# EAGLE design CAN485 1.0.0 (EAGLE 8.2.1)
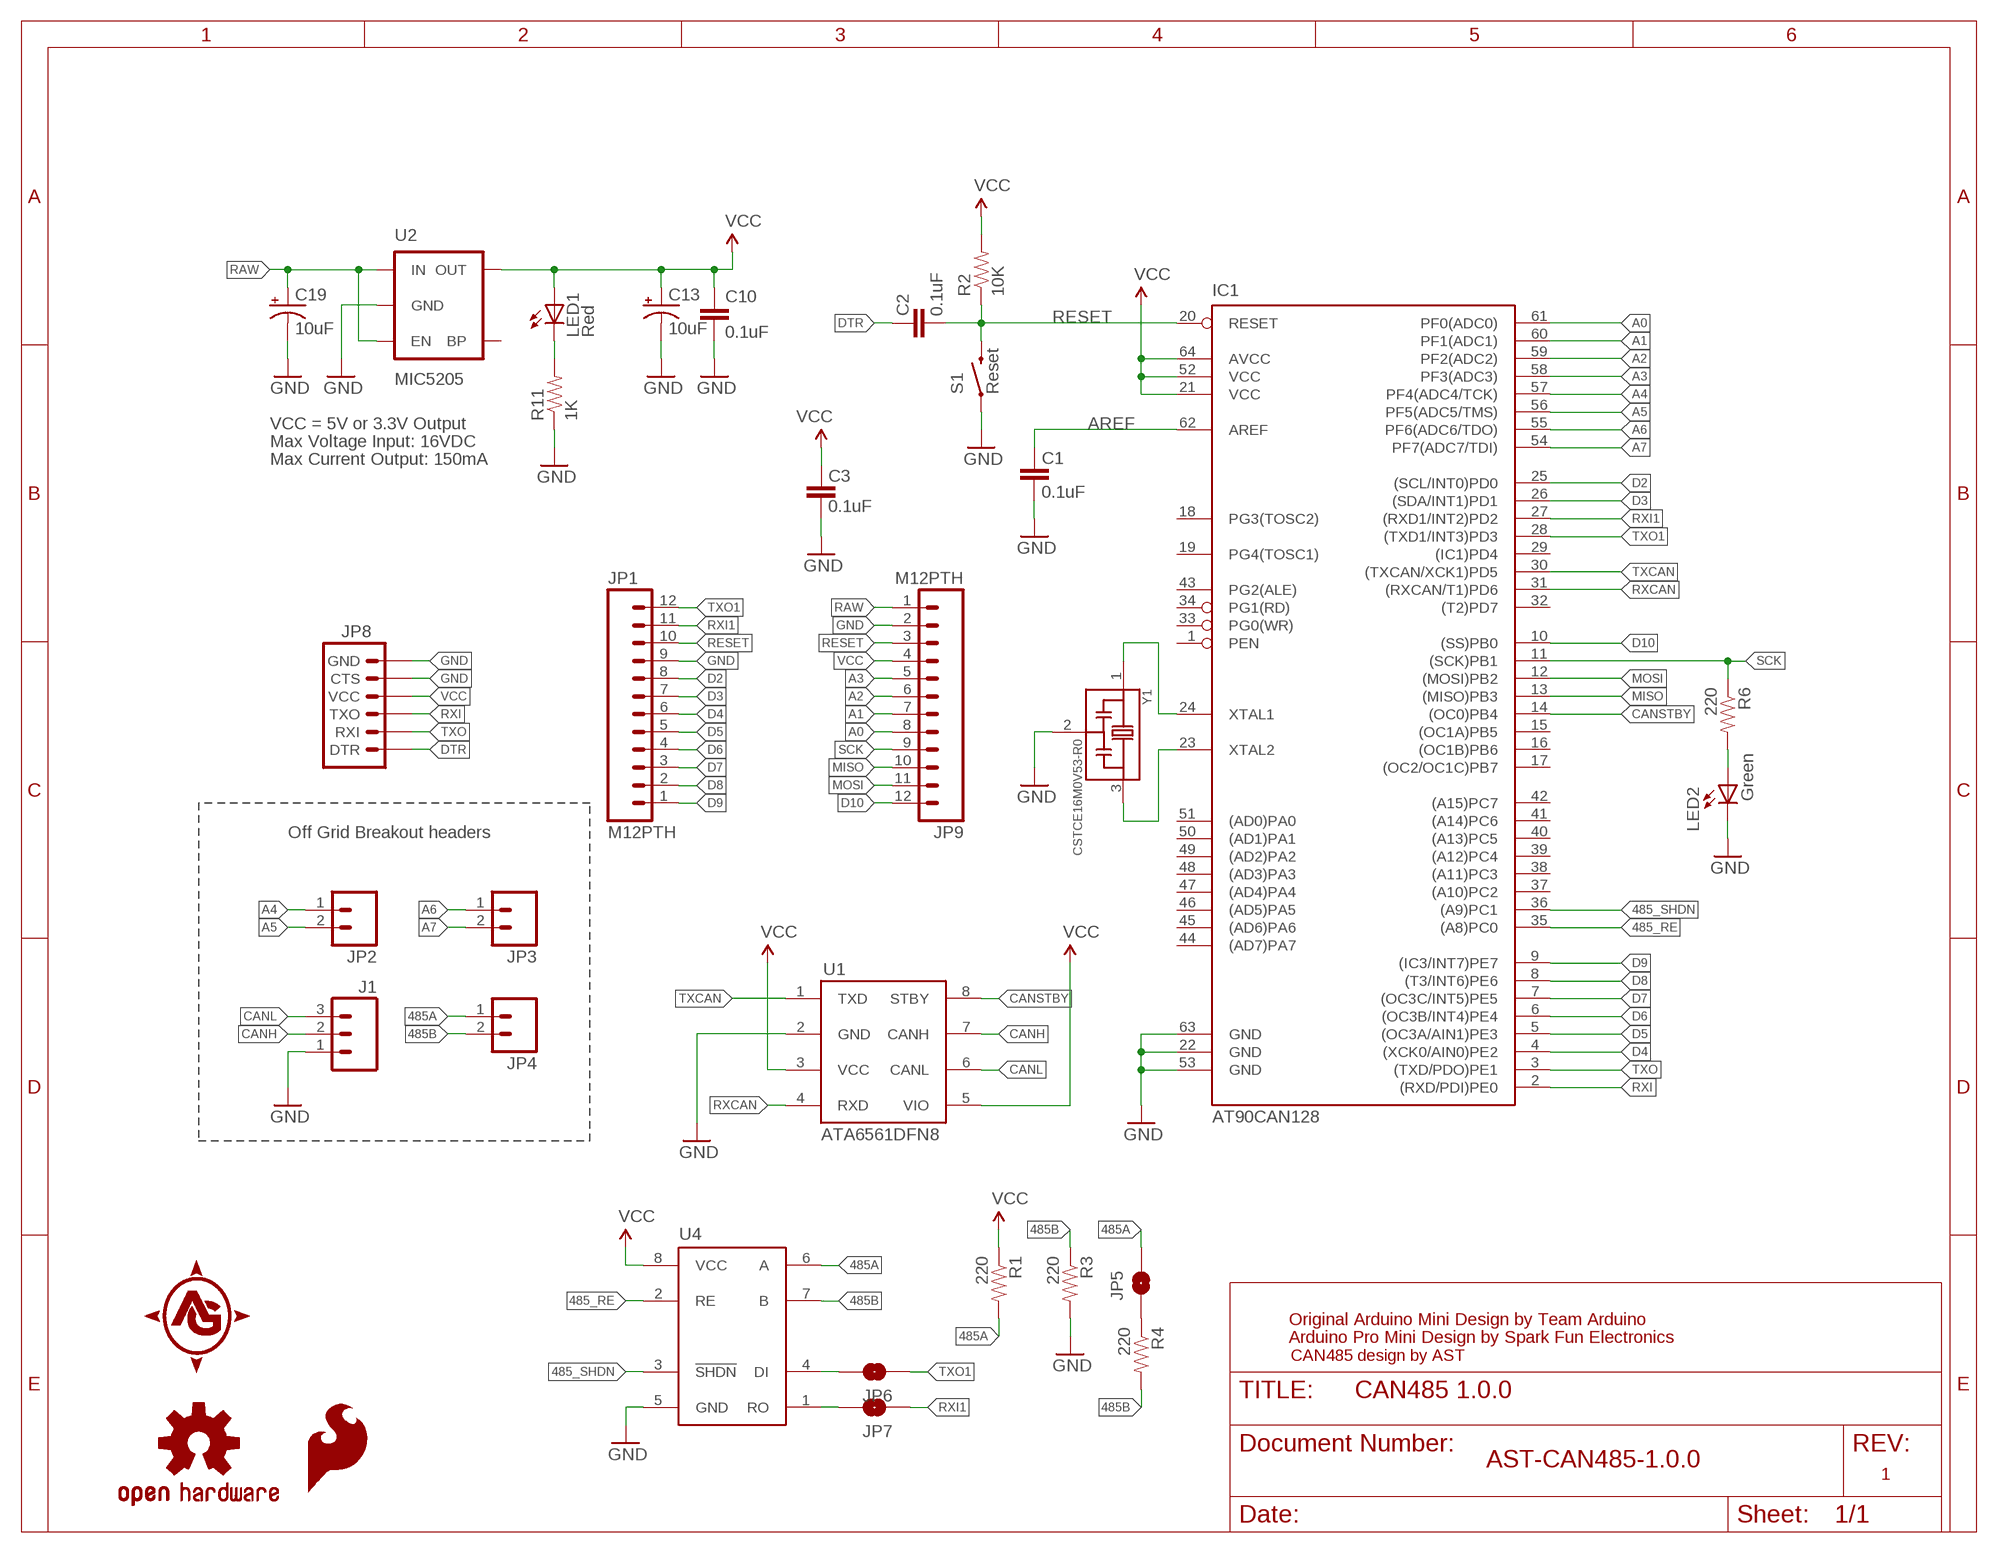
[diagram p0: schematic, sheet 1]

## Parts
C1  0.1uF  CAP0402-CAP  [0402-CAP]
C2  0.1uF  CAP0402-CAP  [0402-CAP]
C3  0.1uF  CAP0402-CAP  [0402-CAP]
C10  0.1uF  CAP0402-CAP  [0402-CAP]
C13  10uF  CAP_POL1206  [EIA3216]
C19  10uF  CAP_POL1206  [EIA3216]
IC1  AT90CAN128  MEGA64-M  [MLF64]
J1  M03PTH  [1X03]
JP1  M12PTH  [1X12]
JP2  M02PTH  [1X02]
JP3  M02PTH  [1X02]
JP4  M02PTH  [1X02]
JP5  JUMPER-PAD-2-NO  [PAD-JUMPER-2-NO_NO_SILK]
JP6  JUMPER-PAD-2-NO  [PAD-JUMPER-2-NO_NO_SILK]
JP7  JUMPER-PAD-2-NO  [PAD-JUMPER-2-NO_NO_SILK]
JP8  ARDUINO_SERIAL_PROGRAMPTH  [1X06]
JP9  M12PTH  [1X12]
LED1  Red  LED  [0603-LED-ALT1]
LED2  Green  LED  [0603-LED-ALT1]
LOGO1  OSHW-LOGOMINI  [OSHW-LOGO-MINI]
LOGO2  SFE_LOGO_FLAME0.05_INCH  [SFE_LOGO_FLAME_.05]
R1  220  RESISTOR0402-RES  [0402-RES]
R2  10K  RESISTOR0402-RES  [0402-RES]
R3  220  RESISTOR0402-RES  [0402-RES]
R4  220  RESISTOR0402-RES  [0402-RES]
R6  220  RESISTOR0402-RES  [0402-RES]
R11  1K  RESISTOR0402-RES  [0402-RES]
S1  Reset  SWITCH-MOMENTARY-2-SMD-1101NE  [TACTILE-SWITCH-1101NE]
U1  ATA6561DFN8  [MSOP8]
U2  MIC5205  V_REG_LDOSMD2  [SC70]
U4  MAX13487SOIC  [MAX13487]
Y1  CSTCE16M0V53-R0  [OSC_CSTCE16M0V53-R0]

## Nets
485_RE: IC1.35((A8)PC0) U4.2(RE)
485_SHDN: IC1.36((A9)PC1) U4.3(!SHDN)
485A: JP4.1 JP5.2 R1.2 U4.6(A)
485B: JP4.2 R3.1 R4.2 U4.7(B)
A0: IC1.61(PF0(ADC0)) JP9.8
A1: IC1.60(PF1(ADC1)) JP9.7
A2: IC1.59(PF2(ADC2)) JP9.6
A3: IC1.58(PF3(ADC3)) JP9.5
A4: IC1.57(PF4(ADC4/TCK)) JP2.1
A5: IC1.56(PF5(ADC5/TMS)) JP2.2
A6: IC1.55(PF6(ADC6/TDO)) JP3.1
A7: IC1.54(PF7(ADC7/TDI)) JP3.2
AREF: C1.2 IC1.62(AREF)
CANH: J1.2 U1.7(CANH)
CANL: J1.3 U1.6(CANL)
CANSTBY: IC1.14((OC0)PB4) U1.8(STBY)
D2: IC1.25((SCL/INT0)PD0) JP1.8
D3: IC1.26((SDA/INT1)PD1) JP1.7
D4: IC1.4((XCK0/AIN0)PE2) JP1.6
D5: IC1.5((OC3A/AIN1)PE3) JP1.5
D6: IC1.6((OC3B/INT4)PE4) JP1.4
D7: IC1.7((OC3C/INT5)PE5) JP1.3
D8: IC1.8((T3/INT6)PE6) JP1.2
D9: IC1.9((IC3/INT7)PE7) JP1.1
D10: IC1.10((SS)PB0) JP9.12
DTR: C2.2 JP8.1(DTR)
GND [vcc]: C1.1 C3.1 C10.2 C13.C(-) C19.C(-) IC1.22(GND) IC1.53(GND) IC1.63(GND) J1.1 JP1.9 JP8.5(CTS) JP8.6(GND) JP9.2 LED2.C R3.2 R11.1 S1.P$1 U1.2(GND) U2.2(GND) U4.5(GND) Y1.2
MISO: IC1.13((MISO)PB3) JP9.10
MOSI: IC1.12((MOSI)PB2) JP9.11
N$1: IC1.23(XTAL2) Y1.3
N$2: IC1.24(XTAL1) Y1.1
N$3: JP5.1 R4.1
N$4: LED1.C R11.2
N$5: JP6.2 U4.4(DI)
N$6: JP7.2 U4.1(RO)
N$7: LED2.A R6.2
RAW [vcc]: C19.A(+) JP9.1 U2.1(IN) U2.3(EN)
RESET: C2.1 IC1.20(RESET) JP1.10 JP9.3 R2.1 S1.P$2
RXCAN: IC1.31((RXCAN/T1)PD6) U1.4(RXD)
RXI: IC1.2((RXD/PDI)PE0) JP8.3(TXO)
RXI1: IC1.27((RXD1/INT2)PD2) JP1.11 JP7.1
SCK: IC1.11((SCK)PB1) JP9.9 R6.1
TXCAN: IC1.30((TXCAN/XCK1)PD5) U1.1(TXD)
TXO: IC1.3((TXD/PDO)PE1) JP8.2(RXI)
TXO1: IC1.28((TXD1/INT3)PD3) JP1.12 JP6.1
VCC: C3.2 C10.1 C13.A(+) IC1.21(VCC) IC1.52(VCC) IC1.64(AVCC) JP8.4(VCC) JP9.4 LED1.A R1.1 R2.2 U1.3(VCC) U1.5(VIO) U2.5(OUT) U4.8(VCC)
Unconnected: IC1.1(PEN) IC1.15((OC1A)PB5) IC1.16((OC1B)PB6) IC1.17((OC2/OC1C)PB7) IC1.18(PG3(TOSC2)) IC1.19(PG4(TOSC1)) IC1.29((IC1)PD4) IC1.32((T2)PD7) IC1.33(PG0(WR)) IC1.34(PG1(RD)) IC1.37((A10)PC2) IC1.38((A11)PC3) IC1.39((A12)PC4) IC1.40((A13)PC5) IC1.41((A14)PC6) IC1.42((A15)PC7) IC1.43(PG2(ALE)) IC1.44((AD7)PA7) IC1.45((AD6)PA6) IC1.46((AD5)PA5) IC1.47((AD4)PA4) IC1.48((AD3)PA3) IC1.49((AD2)PA2) IC1.50((AD1)PA1) IC1.51((AD0)PA0) U2.4(BP)

## Notes on the sheet
- VCC = 5V or 3.3V Output
- Max Voltage Input: 16VDC
- Max Current Output: 150mA
- Off Grid Breakout headers
- Original Arduino Mini Design by Team Arduino
- Arduino Pro Mini Design by Spark Fun Electronics
- CAN485 design by AST
- AST-CAN485-1.0.0
- 1

## Library data of the parts
C1-C3 C10 = SparkFun:CAP: Capacitor Standard 0603 ceramic capacitor, and 0.1" leaded capacitor.
C13 C19 = SparkFun:CAP_POL: Capacitor Polarized These are standard SMD and PTH capacitors. Normally 10uF, 47uF, and 100uF in electrolytic and tantalum varieties. Always verify the external diameter of the through hole cap, it varies with capacity, voltage, and manufacturer. The EIA devices should be standard.
IC1 = atmel:MEGA64: MICROCONTROLLER 64 Kbytes FLASH 4 Kbytes SRAM 2 Kbytes EEPROM DUAL USART 8-channel 10 bit ADC Source: avr.lbr; MPN: ATMEGA64-16MU; OC_FARNELL: 1455120; OC_NEWARK: 58M3742
J1 = SparkFun-Connectors:M03: Header 3 Standard 3-pin 0.1" header. Use with straight break away headers (SKU : PRT-00116), right angle break away headers (PRT-00553), swiss pins (PRT-00743), machine pins (PRT-00117), and female headers (PRT-00115). Molex polarized connector foot print use with SKU : PRT-08232 with associated crimp pins and housings.
JP1 JP9 = SparkFun:M12: Header 12 Standard 12-pin 0.1" header. Use with straight break away headers (SKU : PRT-00116), right angle break away headers (PRT-00553), swiss pins (PRT-00743), machine pins (PRT-00117), and female headers (PRT-00115).
JP2-JP4 = SparkFun:M02: Header 2 Standard 2-pin 0.1" header. Use with straight break away headers (SKU : PRT-00116), right angle break away headers (PRT-00553), swiss pins (PRT-00743), machine pins (PRT-00117), and female headers (PRT-00115). Molex polarized connector foot print use with SKU : PRT-08233 with associated crimp pins and housings.
JP5-JP7 = SparkFun-Passives:JUMPER-PAD-2-NO
JP8 = SparkFun:ARDUINO_SERIAL_PROGRAM
LED1 LED2 = Testing:LED: LEDs Standard schematic elements and footprints for 5mm, 3mm, 1206, and 0603 sized LEDs. 5mm - Spark Fun Electronics SKU : COM-00529 (and others)
LOGO1 = SparkFun-Aesthetics:OSHW-LOGO: Open Source Hardware Logo This logo indicates the piece of hardware it is found on incorporates a OSHW license and/or adheres to the definition of open source hardware found here: http://freedomdefined.org/OSHW
LOGO2 = SparkFun-Aesthetics:SFE_LOGO_FLAME: SFE Logo, flame only This is the SparkFun flame logo. The logo on the schematic will always be the same size; the package variant is the height of the flame. Default layer for the logo on the board is tSilk.
R1-R4 R6 R11 = SparkFun:RESISTOR: Resistor Basic schematic elements and footprints for 0603, 1206, and PTH resistors.
S1 = Testing:SWITCH-MOMENTARY-2: Various NO switches- pushbuttons, reed, etc
U1 = atmel:ATA6561: High speed CAN transceiver
U2 = SparkFun:V_REG_LDO: Voltage Regulator LDO Standard 150mA LDO voltage regulator in SOT-23 layout. Micrel part MIC5205. BP (by-pass) pin is used to lower output noise with 470pF cap.
U4 = AET:MAX13487
Y1 = CSTCE16M0V53-R0:CSTCE16M0V53-R0: 16MHz Ceramic Resonator Built in Capacitor 15pF ±0.3% -20°C ~ 80°C Surface Mount; AVAILABILITY: Good; DESCRIPTION: Ceramic Resonator 16MHz ??0.5% (Tol) ??0.3% (Stability) 15pF 40Ohm 3-Pin CSMD T/R; MF: Murata; MP: CSTCE16M0V53-R0; PACKAGE: SMD-3 Murata; PRICE: 0.29 USD

## Net classes
0 default: width 0.203 mm
1 vcc: width 0.254 mm

## Board
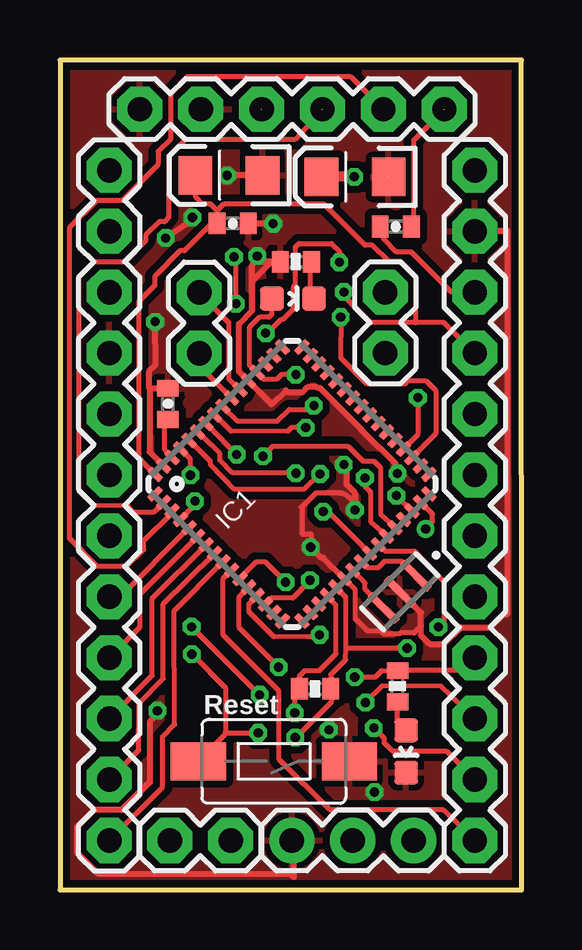
[diagram p1: board, top side]
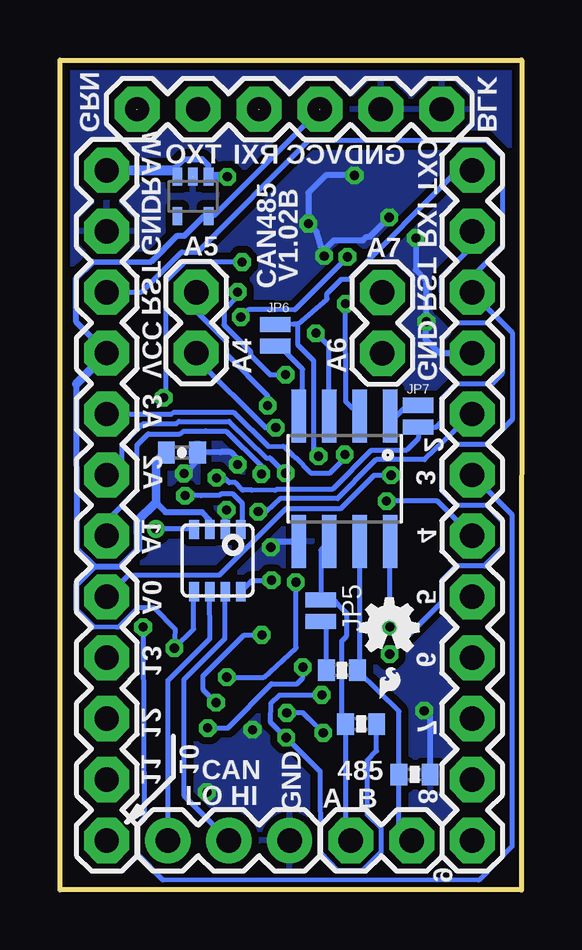
[diagram p2: board, bottom side, seen from below]

Size 19.25 x 34.6 mm. Coordinates in mm from the lower left corner, seen from the top.
Outline: 0,34.6 0.01,0 19.25,0 19.24,34.6 0,34.6
Copper layers (1*16): Top 0.035mm / dielectric 1.5mm / Bottom 0.035mm
Design rules "SparkFun-2-layer-TIGHT *": minimum track width 7mil, minimum drill 15mil, track to track 7mil, track to pad 7mil, pad to pad 7mil, via to via 7mil, smd to smd 7mil, copper to edge 7mil, drill to drill 7mil, minimum pad ring 7mil, minimum via ring 7mil, stop-mask expansion 4mil, vias tented up to drill 25mil, thermal gap 10mil

### Footprints (pad centres in the part's own frame; a part is rotated, then mirrored left to right if it is on the bottom)
0402-CAP = smd 0.7 x 0.9: 1 -0.65,0; 2 0.65,0
EIA3216 = smd 1.4 x 1.6: A 1.4,0; C -1.4,0
MLF64 = smd 0.7 x 0.3: 1 -4.325,3.75; 2 -4.325,3.25; 3 -4.325,2.75; 4 -4.325,2.25; 5 -4.325,1.75; 6 -4.325,1.25; 7 -4.325,0.75; 8 -4.325,0.25; 9 -4.325,-0.25; 10 -4.325,-0.75; 11 -4.325,-1.25; 12 -4.325,-1.75; 13 -4.325,-2.25; 14 -4.325,-2.75; 15 -4.325,-3.25; 16 -4.325,-3.75; 33 4.325,-3.75; 34 4.325,-3.25; 35 4.325,-2.75; 36 4.325,-2.25; 37 4.325,-1.75; 38 4.325,-1.25; 39 4.325,-0.75; 40 4.325,-0.25; 41 4.325,0.25; 42 4.325,0.75; 43 4.325,1.25; 44 4.325,1.75; 45 4.325,2.25; 46 4.325,2.75; 47 4.325,3.25; 48 4.325,3.75 | smd 0.3 x 0.7: 17 -3.75,-4.325; 18 -3.25,-4.325; 19 -2.75,-4.325; 20 -2.25,-4.325; 21 -1.75,-4.325; 22 -1.25,-4.325; 23 -0.75,-4.325; 24 -0.25,-4.325; 25 0.25,-4.325; 26 0.75,-4.325; 27 1.25,-4.325; 28 1.75,-4.325; 29 2.25,-4.325; 30 2.75,-4.325; 31 3.25,-4.325; 32 3.75,-4.325; 49 3.75,4.325; 50 3.25,4.325; 51 2.75,4.325; 52 2.25,4.325; 53 1.75,4.325; 54 1.25,4.325; 55 0.75,4.325; 56 0.25,4.325; 57 -0.25,4.325; 58 -0.75,4.325; 59 -1.25,4.325; 60 -1.75,4.325; 61 -2.25,4.325; 62 -2.75,4.325; 63 -3.25,4.325; 64 -3.75,4.325
1X03 = drill 1.016 pad 1.88: 1 0,0; 2 2.54,0; 3 5.08,0
1X12 = drill 1.016 pad 1.88 octagon: 1 0,0; 2 2.54,0; 3 5.08,0; 4 7.62,0; 5 10.16,0; 6 12.7,0; 7 15.24,0; 8 17.78,0; 9 20.32,0; 10 22.86,0; 11 25.4,0; 12 27.94,0
1X02 = drill 1.016 pad 1.88 octagon: 1 0,0; 2 2.54,0
PAD-JUMPER-2-NO_NO_SILK = smd 0.635 x 1.27: 1 -0.45,0; 2 0.45,0
1X06 = drill 1.016 pad 1.88 octagon: 1 0,0; 2 2.54,0; 3 5.08,0; 4 7.62,0; 5 10.16,0; 6 12.7,0
0603-LED-ALT1 = smd 1 x 1: A 0,-0.877; C 0,0.877
0402-RES = smd 0.7 x 0.9: 1 -0.65,0; 2 0.65,0
TACTILE-SWITCH-1101NE = smd 2.3 x 1.6: P$1 -3.15,0; P$2 3.15,0
MSOP8 = smd 0.4 x 0.8: 1 -0.975,-1.298; 2 -0.325,-1.298; 3 0.325,-1.298; 4 0.975,-1.298; 5 0.975,1.298; 6 0.325,1.298; 7 -0.325,1.298; 8 -0.975,1.298
SC70 = smd 0.4 x 0.75: 1 -0.65,-0.825; 2 0,-0.825; 3 0.65,-0.825; 4 0.65,0.825; 5 -0.65,0.825
MAX13487 = smd 0.61 x 2.21: 1 -1.905,-2.616; 2 -0.635,-2.616; 3 0.635,-2.616; 4 1.905,-2.616; 5 1.905,2.616; 6 0.635,2.616; 7 -0.635,2.616; 8 -1.905,2.616
OSC_CSTCE16M0V53-R0 = smd 0.3 x 1.6: 1 -0.95,0; 2 0,0; 3 0.95,0

### Placement (x,y rotation side)
C1  4.5,20.26 270 top
C2  14.01,27.65 0 top
C3  14.16,18.23 180 bottom
C10  7.21,27.78 0 top
C13  7.05,29.79 180 top
C19  12.31,29.72 180 top
IC1  9.68,16.92 45 top
J1  9.67,2.06 0 top
JP1  2.06,2.06 90 top
JP2  13.57,22.38 90 top
JP3  5.81,22.37 90 top
JP4  7.12,2.06 180 top
JP5  8.38,11.64 90 bottom
JP6  10.28,23.12 270 bottom
JP7  4.32,19.75 90 bottom
JP8  16.03,32.55 180 top
JP9  17.3,30 270 top
LED1  9.71,24.65 270 top
LED2  14.43,5.77 180 top
LOGO1  5.51,10.94 0 bottom
LOGO2  6.27,7.48 0 bottom
R1  6.69,6.92 180 bottom
R2  10.64,8.38 0 top
R3  4.46,4.81 0 bottom
R4  7.49,9.16 0 bottom
R6  14.08,8.49 270 top
R11  9.84,26.19 0 top
S1  8.92,5.36 180 top
U1  12.68,13.73 180 bottom
U2  13.7,28.91 180 bottom
U4  7.38,17.14 180 bottom
Y1  14.17,12.43 225 top

### Tracks (layer width: path | path; a pad name or v marks a point on that pad's centre or on a via)
485_RE  (via drill 0.38)
  Top 0.203: v11.71,23.88 11.7,22.19 12.78,21.12 14.43,21.12 14.54,21.23 15.25,21.23 15.67,20.81 15.67,19.03 14.69,18.05 IC1.35 | v7.26,26.39 7.34,26.31 v7.34,24.44
  Bottom 0.203: v11.71,23.88 11.39,24.19 10.4,24.19 9.46,24.18 v7.26,26.39 | v7.34,24.44 7.33,20.34 U4.2
485_SHDN  (via drill 0.38)
  Top 0.203: v14.93,20.52 14.92,18.99 IC1.36 | v11.65,26.17 11.65,26.63 11.33,26.95 9.97,26.95 9.82,26.8 9.82,25.23 9.74,25.15 9.74,24.21 9.32,23.79 9.24,23.79 8.66,23.21 v8.58,23.21
  Bottom 0.203: v14.93,20.52 14.84,20.65 14.84,25.39 14.06,26.17 v11.65,26.17 | v8.58,23.21 8.04,22.67 8.04,20.77 8.08,20.54 8.11,19.85 U4.3
485A
  Bottom 0.203: U4.6 8.37,14.17 JP5.2 8.27,12.05 7.78,12.05 7.47,11.71 7.29,11.53 7.29,10.59 7.49,10.39 7.49,7.12 7.39,7.01 R1.2 7.33,2.27 JP4.1
485B
  Bottom 0.203: JP4.2 4.55,2.09 5.11,2.65 R3.1 5.11,7.44 6.82,9.11 R4.2 6.79,9.25 6.75,9.29 U4.7
A0  (via drill 0.38)
  Top 0.203: v5.44,17.29 5.44,17.96 5.19,18.21 5.19,18.23 5.05,18.37 IC1.61
  Bottom 0.203: v5.44,17.29 6.14,17.29 7.53,15.91 9.82,15.91 12.59,13.14 16.38,13.14 JP9.8
A1  (via drill 0.38)
  Top 0.203: v10.85,17.34 v10.84,17.35 10.18,16.7 7.29,16.7 6.28,17.73 6.28,17.87 5.61,18.53 5.59,18.53 IC1.60
  Bottom 0.203: v10.85,17.34 10.85,17.67 12.33,19.13 13.16,19.14 14.09,19.13 14.24,19.01 15.57,19.01 16.04,18.54 16.03,16.67 17.28,15.4 JP9.7
A2  (via drill 0.38)
  Top 0.203: v9.84,17.37 9.71,17.39 7.2,17.39 6.67,17.92 6.67,18.19 5.97,18.89 5.95,18.89 IC1.59
  Bottom 0.203: v9.84,17.37 10.49,18.01 10.64,18.01 12.19,19.53 14.3,19.53 14.4,19.44 15.78,19.44 16.66,18.56 16.66,17.94 JP9.6
A3  (via drill 0.38)
  Top 0.203: v7.37,18.15 6.25,19.27 6.25,19.29 6.11,19.43 IC1.58
  Bottom 0.203: v7.37,18.15 7.53,17.99 7.53,17.84 7.98,17.39 8.8,17.39 9.43,18.02 9.55,18.13 9.93,18.5 10.56,18.49 12.02,19.92 14.5,19.92 14.61,19.83 JP9.5
A4  (via drill 0.38)
  Top 0.203: v10.25,19.27 9.65,19.27 9.49,19.12 7.13,19.13 6.67,19.59 6.65,19.59 IC1.57
  Bottom 0.203: v10.25,19.27 10.68,19.27 13.53,22.12 JP2.1
A5  (via drill 0.38)
  Top 0.203: IC1.56 6.85,20.16 6.84,20.15 IC1.56 | 6.79,20.18 IC1.56 | IC1.56 7.41,19.54 9.06,19.54 9.55,20.03 10.41,20.03 v10.59,20.19
  Bottom 0.203: v10.59,20.19 10.58,20.59 12.29,22.31 12.3,22.86 13.58,24.14 13.58,24.33 JP2.2
A6
  Top 0.203: IC1.55 | IC1.55 5.82,21.84 JP3.1 | IC1.55
A7
  Top 0.203: JP3.2 7.04,23.66 7.04,21.31 7.49,20.88 7.49,20.87 IC1.54
AREF
  Top 0.203: IC1.62 4.67,18.05 4.67,18.06 4.35,18.38 4.35,19.5 C1.2
CANH
  Bottom 0.203: U1.7 12.37,10.48 14.07,8.78 14.07,3.93 J1.2
CANL
  Bottom 0.203: J1.3 14.74,8.74 13,10.48 U1.6
CANSTBY  (via drill 0.38)
  Top 0.203: v10.43,12.91 10.09,12.57 10.09,12.55 9.71,12.17 8.81,12.17 IC1.14
  Bottom 0.203: v10.43,12.91 11.23,12.91 11.69,12.45 U1.8
D2  (via drill 0.38)
  Top 0.203: v10.98,15.77 11.17,15.77 12.69,14.25 12.71,14.25 IC1.25
  Bottom 0.203: v10.98,15.77 10.64,15.77 10.06,16.31 7.67,16.31 6.28,17.73 6.17,17.85 6.07,17.94 4.05,17.94 JP1.8
D3  (via drill 0.38)
  Top 0.203: v15.78,10.96 v15.78,10.95 16.03,11.2 16.03,12.85 14.82,14.12 13.57,14.12 13.29,14.39 IC1.26
  Bottom 0.203: v15.78,10.96 15.77,10.74 15.77,10.7 15.72,3 16.02,2.7 16.02,1.48 14.96,0.42 1.79,0.41 0.4,1.81 0.4,15.65 JP1.7
D4  (via drill 0.38)
  Top 0.203: v5.63,16.21 5.69,16.15 5.69,16.13 5.19,15.63 5.19,15.61 5.05,15.47 IC1.4
  Bottom 0.203: v5.63,16.21 3.51,16.21 JP1.6
D5
  Top 0.203: IC1.5 2.5,12.22 JP1.5
D6
  Top 0.203: JP1.4 3.34,10.96 3.34,12.34 IC1.6
D7
  Top 0.203: JP1.3 3.85,8.94 3.85,12.16 IC1.7
D8
  Top 0.203: JP1.2 3.03,5.56 3.29,5.82 3.3,7.77 4.31,8.8 4.31,11.92 IC1.8
D9
  Top 0.203: JP1.1 4.28,4.28 4.28,6.39 4.79,6.9 4.77,11.64 6.77,13.65 IC1.9
D10
  Top 0.203: JP9.12 15.98,3.33 11.27,3.33 9.14,5.45 9.13,8.29 6.81,10.63 6.81,12.98 IC1.10
DTR  (1 unrouted)
  Top 0.203: 16.03,32.53 14.74,31.24 14.74,27.74 C2.2
GND  (via drill 0.38)  (1 unrouted)
  Top 0.203: 15.06,10.61 15.06,11.01 14.76,10.71 14.75,10.73 14.21,10.73 14.17,10.69 13.48,10.69 13.38,10.79 12.83,10.79 12.31,11.31 12.31,12.52 IC1.22 | v12.3,15.84 arc90 11.59,16.55 10.68,16.55 10.07,15.95 10.09,15.95 10.09,14.84 10.46,14.84 v10.46,14.29
  Top 0.254: v3.97,23.69 3.97,23.61 3.98,21.9 3.98,21.89 3.72,21.63 3.72,20.91 C1.1 3.73,20.91 3.73,18.27 IC1.63 | v14.08,17.36 13.99,17.45 13.99,17.77 12.64,19.12 12.52,19.25 10.84,20.93 10.74,20.93 10.71,20.96 10.33,20.96 10.11,20.74 9.5,20.74 9.42,20.82 8.82,20.24 8.82,20.25 IC1.53 7.46,21.61 7.46,23.6 8.02,24.16 | 8.02,24.16 8.03,24.17 8.03,25.41 8.82,26.19 | 8.82,26.19 R11.1 | 8.82,26.19 8.55,26.19 arc-90 v8.23,26.43 8.02,26.03 8.02,24.16 | v8.89,27.78 C10.2 | C13.C 6.99,29.79 6.96,29.82 v6.96,29.8 v6.97,29.79 | IC1.22 10.97,13.85 10.9,13.85 v10.46,14.29 | v12.3,15.84 12.3,16.56 11.96,16.9 11.96,17.73 v11.84,17.73 | v5.52,28.04 5.67,28.03 v4.41,27.18 | v4.06,7.47 4.06,7.33 3.74,7.01 3.74,4.5 2.58,3.33 1.43,3.33 0.7,2.61 0.7,1.57 1.59,0.68 9.6,0.68 9.75,0.53 9.75,1.98 J1.1 | Y1.2 14.67,11.95 14.71,11.91 14.85,11.76 14.81,11.8 15.06,11.55 15.06,11.01 | 15.06,10.61 15.41,10.26 16.03,10.26 16.73,10.95 17.96,10.95 18.5,11.49 18.62,11.48 18.67,11.53 18.67,27.47 18.66,27.46 JP9.2
  Bottom 0.254: JP1.9 3.42,22.38 4.03,22.99 v3.97,23.69 v3.98,23.7 3.98,25.43 4.41,25.86 v4.41,27.18 | v14.08,17.36 13.82,17.62 13.78,17.62 13.43,18.01 C3.1 12.55,18.25 12.12,18.25 11.84,17.97 v11.84,17.73 | v6.97,29.79 8.16,29.79 8.89,29.06 v8.89,27.78 8.55,27.44 v8.23,26.43 8.47,26.44 7.83,27.08 6.61,27.08 6.46,27.23 6.32,27.23 v5.52,28.04 | v10.46,14.29 10.52,14.34 10.33,14.53 U4.5 | U1.2 12.36,15.96 v12.3,15.84 | R3.2 3.81,7.22 v4.06,7.47
  other vias: 11.22,6.68 13.12,4.08
  pour Top (isolate 0.305): 0.13,34.59 19.11,34.69 19.17,0.02 0.19,-0.08
  pour Bottom (isolate 0.305): 0.13,34.62 19.11,34.67 19.14,0.02 0.16,-0.03
MISO  (via drill 0.38)
  Top 0.203: v10.83,10.63 10.75,10.55 10.33,10.55 8.91,10.56 7.89,11.58 7.88,11.92 8.21,12.25 IC1.13 | v12.74,7.81 13.44,8.5 15.89,8.49 JP9.10
  Bottom 0.203: v10.83,10.63 11.57,10.63 12.86,9.34 13.29,8.92 13.28,8.35 12.71,7.77 v12.74,7.81
MOSI  (via drill 0.38)
  Top 0.203: v9.12,9.29 8.56,9.86 7.47,10.95 7.47,12.22 7.67,12.42 IC1.12 | v13.09,6.75 13.53,6.32 13.53,6.13 13.89,5.77 16.13,5.77 JP9.11
  Bottom 0.203: v9.12,9.29 9.12,8.84 9.36,8.59 10.43,8.59 12.25,6.75 v13.09,6.75
N$1
  Top 0.203: Y1.3 12.72,12.56 12.72,12.79 12.21,13.3 IC1.23
N$2
  Top 0.203: Y1.1 14.25,13.7 13.53,13.7 13.26,13.43 12.83,13.43 12.58,13.68 IC1.24
N$3
  Bottom 0.203: R4.1 8.15,10.97 JP5.1
N$4
  Top 0.203: R11.2 10.45,26.19 10.45,24.75 10.59,24.61 LED1.C
N$5
  Bottom 0.203: U4.4 9.13,19.91 9.13,21.71 9.15,21.74 9.53,22.12 10.03,22.61 JP6.2
N$6
  Bottom 0.203: JP7.2 4.78,20.2 5.22,19.76 U4.1
N$7
  Top 0.203: R6.2 14.08,6.9 LED2.A
RAW  (via drill 0.38)
  Top 0.254: C19.A
  Top 0.406: v12.27,29.73 C19.A
  Bottom 0.254: 14.47,30.01 U2.3 14.35,29.75 14.35,30.21 14.09,30.47 13.33,30.47 13.07,30.21 13.07,29.75 U2.1 12.93,29.73 | JP9.1
  Bottom 0.406: JP9.1 14.47,30.01 | 12.93,29.73 v12.27,29.73
RESET  (via drill 0.38)
  Top 0.203: IC1.20 11.15,12.25 11.51,11.89 11.52,9.84 10.83,9.15 10.21,9.15 9.99,8.93 R2.1 9.8,8.21 v9.79,7.38 | 6.95,6.55 v8.27,6.55 | 6.95,6.55 S1.P$2 | C2.1 13.53,27.65 13.51,27.63 13.51,27.13 14.04,26.6 14.65,26.6 16.32,24.93 JP9.3 | v5.5,9.83 6.9,8.43 6.9,6.59 6.95,6.55
  Bottom 0.203: v8.27,6.55 8.87,7.14 9.11,7.38 v9.79,7.38 | JP9.3 15.85,24.93 14.17,26.6 13.51,26.6 8.87,31.25 1.44,31.25 0.8,30.61 0.8,26.81 2.05,25.56 JP1.10 2.01,24.83 0.39,23.23 0.39,19.61 1.44,18.56 2.69,18.57 3.34,17.92 3.34,16.67 2.71,16.04 1.47,16.04 0.8,15.37 0.8,14.25 1.55,13.5 2.71,13.5 3.34,12.88 3.34,11.98 5.5,9.85 v5.5,9.83
RXCAN  (via drill 0.38)
  Top 0.203: v15.25,15.05 15.54,15.34 15.54,15.67 15.43,15.77 IC1.31
  Bottom 0.203: v15.25,15.05 13.67,15.05 U1.4
RXI  (1 unrouted)
  Top 0.203: 10.95,32.53 9.8,31.28 5.23,31.28 4.54,30.6 4.54,28.04 4.36,27.86 4.15,27.86 3.58,27.29 3.58,27.07 2.69,26.18 1.41,26.18 0.79,25.55 0.79,16.66 1.43,16.03 2.78,16.04 3.06,15.76 3.92,15.76 IC1.2
RXI1  (via drill 0.38)
  Top 0.203: v12.72,17.18 12.72,16.81 12.95,16.58 12.95,15.37 13.4,14.96 IC1.27
  Bottom 0.203: v12.72,17.18 12.72,17.16 12.37,17.16 12.19,16.98 11.93,16.98 11.63,16.67 11.25,16.67 10.29,16.66 10.2,16.7 7.89,16.7 6.26,18.33 4.79,18.34 4.31,18.82 JP7.1 | JP7.1 3.56,19.29 3.33,19.52 3.33,20.48 2.69,21.12 1.22,21.12 0.79,21.55 0.79,23 1.41,23.63 2.68,23.63 3.33,24.28 3.34,25.55 2.08,26.81 JP1.11 | JP7.1
SCK  (via drill 0.38)
  Top 0.203: v9.41,12.83 8.57,13.67 8.17,13.67 7.71,13.21 7.71,13.19 IC1.11 | v12.29,8.87 13.14,8.87 13.41,9.14 R6.1 16.73,9.15 JP9.9
  Bottom 0.203: v9.41,12.83 9.4,10.09 10.74,8.87 v12.29,8.87
TXCAN  (via drill 0.38)
  Top 0.203: v14.03,16.44 14.14,16.34 IC1.30
  Bottom 0.203: v14.03,16.44 13.36,16.44 12.6,16.45 12.54,16.5 12.03,16.5 11.64,16.12 11.64,15.1 U1.1
TXO
  Top 0.203: JP8.2 12.13,33.9 5.3,33.9 4.61,33.19 4.61,31.28 4.09,30.78 4.09,30.24 2.6,28.74 1.53,28.74 0.39,27.61 0.39,14.67 1.54,13.5 2.79,13.5 3.49,14.19 3.49,14.54 4.67,15.71 4.67,15.79 IC1.3
TXO1  (via drill 0.38)
  Top 0.203: v8.47,18.08 8.88,18.5 12.01,18.5 12.64,17.88 13.1,17.88 13.37,17.61 13.37,15.67 13.75,15.31 13.77,15.31 IC1.28
  Bottom 0.203: v8.47,18.08 8.65,18.23 8.66,19.21 8.66,22.05 9.32,22.71 9.32,23.58 9.51,23.58 JP6.1 9.33,23.58 8.11,24.64 8.11,24.87 7.52,25.46 7.17,25.46 2.67,29.99 JP1.12
VCC  (via drill 0.38)  (1 unrouted)
  Top 0.203: 11.92,10.09 11.91,9.59 11.3,8.98 R2.2 11.31,8.96 11.32,7.83 v9.82,6.35 v9.81,6.35 | 11.92,10.09 11.92,12.2 IC1.21 | v14.48,10.08 14.07,10.09 11.92,10.09 | v8.33,8.13 v5.49,10.97 | IC1.64 3.29,18 3.29,24.53 3.95,25.19 3.95,25.57 5.02,26.65 5.19,26.65 6.34,27.79 C10.1 | C13.A 5.65,28.91 5.95,28.59 6.29,28.59 6.56,28.32 C10.1 | IC1.52 7.89,21.9 7.89,23.44 8.33,23.88 8.71,23.88 8.84,24.01 LED1.A | IC1.52 8.5,21.28 9.03,21.28 9.23,21.48 v9.84,21.48 | 14.84,23.65 16.02,23.65 JP9.4 | 14.84,23.65 12.95,23.65 11.84,24.76 v11.84,24.93 | IC1.52 | 14.84,23.65 14.84,25.55 14.2,26.19 13.71,26.19 13.02,26.88 12.72,26.88 11.02,28.58 6.83,28.58 6.56,28.31 C10.1
  Bottom 0.203: U1.5 13.67,10.88 v14.48,10.08 14.45,10.89 15.31,11.75 16,11.75 16.81,10.95 16.9,10.95 17.85,10.96 18.56,11.68 | R1.1 6.05,5.79 6.43,5.41 6.43,3.14 5.85,2.56 5.85,1.58 6.61,0.82 7.69,0.82 8.39,1.55 8.4,4.95 v9.81,6.35 v9.82,6.34 10.46,6.98 10.44,7.8 10.1,8.13 v8.33,8.13 | v5.49,10.97 5.49,14.51 U4.8 | 15.28,16.12 15.25,16.15 | 8.41,32.53 12.85,28.09 U2.5 | v11.84,24.93 11.84,24.75 12.41,24.18 12.41,23.55 11.31,22.45 11.31,22.3 10.49,21.48 v9.84,21.48 | 17.83,13.49 17.81,13.49 | 17.35,22.29 JP9.4
  Bottom 0.254: 13.01,15.05 13.02,15.43 13.32,15.75 14.85,15.75 15.25,16.15 | 16,14.23 16.74,13.48 17.81,13.49 18.56,12.74 18.56,11.68 | JP9.4 18.57,23.67 18.58,25.48 17.87,26.18 15.43,26.2 14.36,27.27 14.06,27.27 13.25,28.08 U2.5 | 17.83,13.49 17.91,13.58 18.55,14.22 18.57,21.1
  Bottom 0.35: 15.25,16.15 15.25,17.85 14.86,18.24 C3.2 | 15.28,16.12 16.01,15.41 16,14.23 | 17.35,22.29 18.57,21.1
  Bottom 0.406: 13.01,15.05 U1.3

### Text on the board
tPlace: Reset
bPlace: BLK | GRN | GND | VCC | RXI | TXO | TXO | RAW | RXI | A7 | A5 | GND | V1.02B | CAN485 | RST | RST | A6 | A4 | GND | VCC | A3 | 2 | 3 | A2 | 4 | A1 | 5 | A0 | 6 | 13 | 7 | GND | CAN | 12 | 485 | LO HI | 10 | 11 | 8 | A B | 9